# Altium schematic sheet V1_sch.SchDoc
size A1; SheetNumber: 1; SheetTotal: 5; SPICEModelCacheQUSBBUGH: <root> / <DocumentId>QUSBBUGH</DocumentId> / <CacheFrame Number="0"> / <Model Name="0805_885012107018_4.7uf" Kind="CKT"> / <Text>******* / .subckt 0805_885012107018_4.7uF 1 2 / Rser 1 3 0.00349429730952 / Lser 2 4 2.52123218E-10 / C1 3 4 0.0000047 / Rpar 3 4 20000000 / .ends 0805_885012107018_4.7uF</Text> / </Model> / </CacheFrame> / </root>
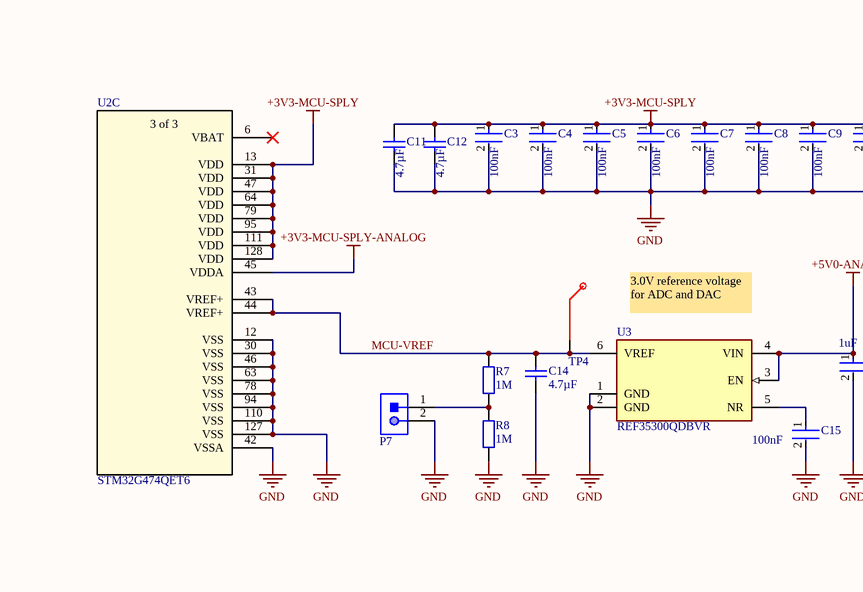
[diagram p0: V1_sch.SchDoc, top left]
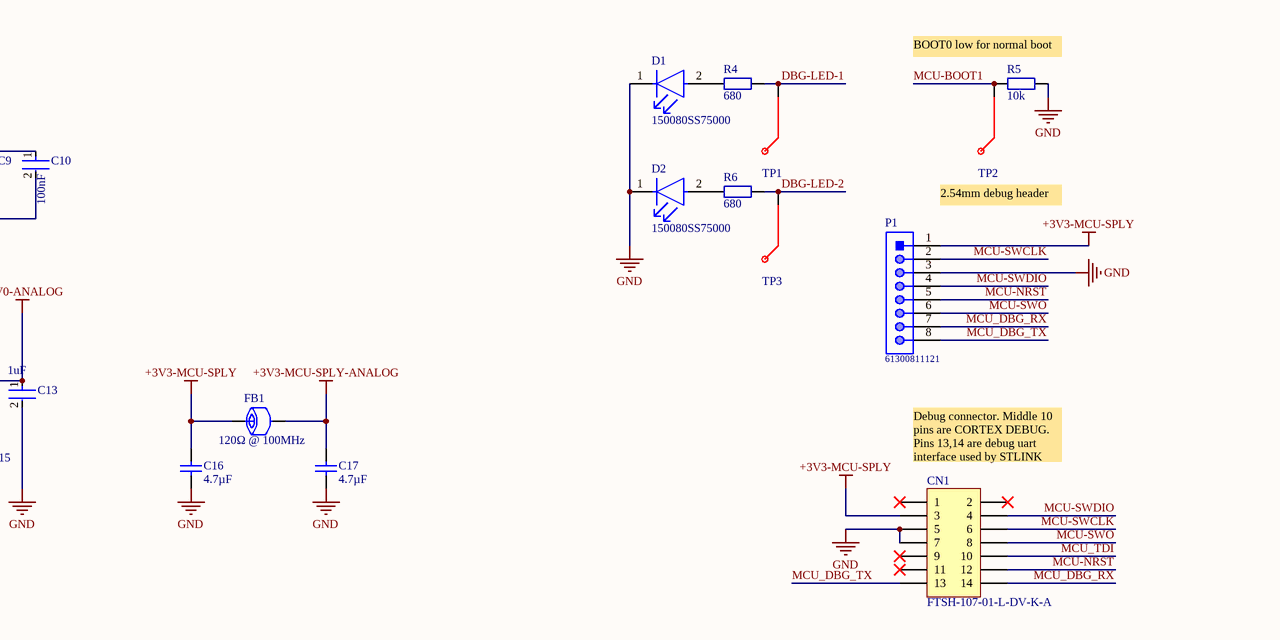
[diagram p1: V1_sch.SchDoc, top right]
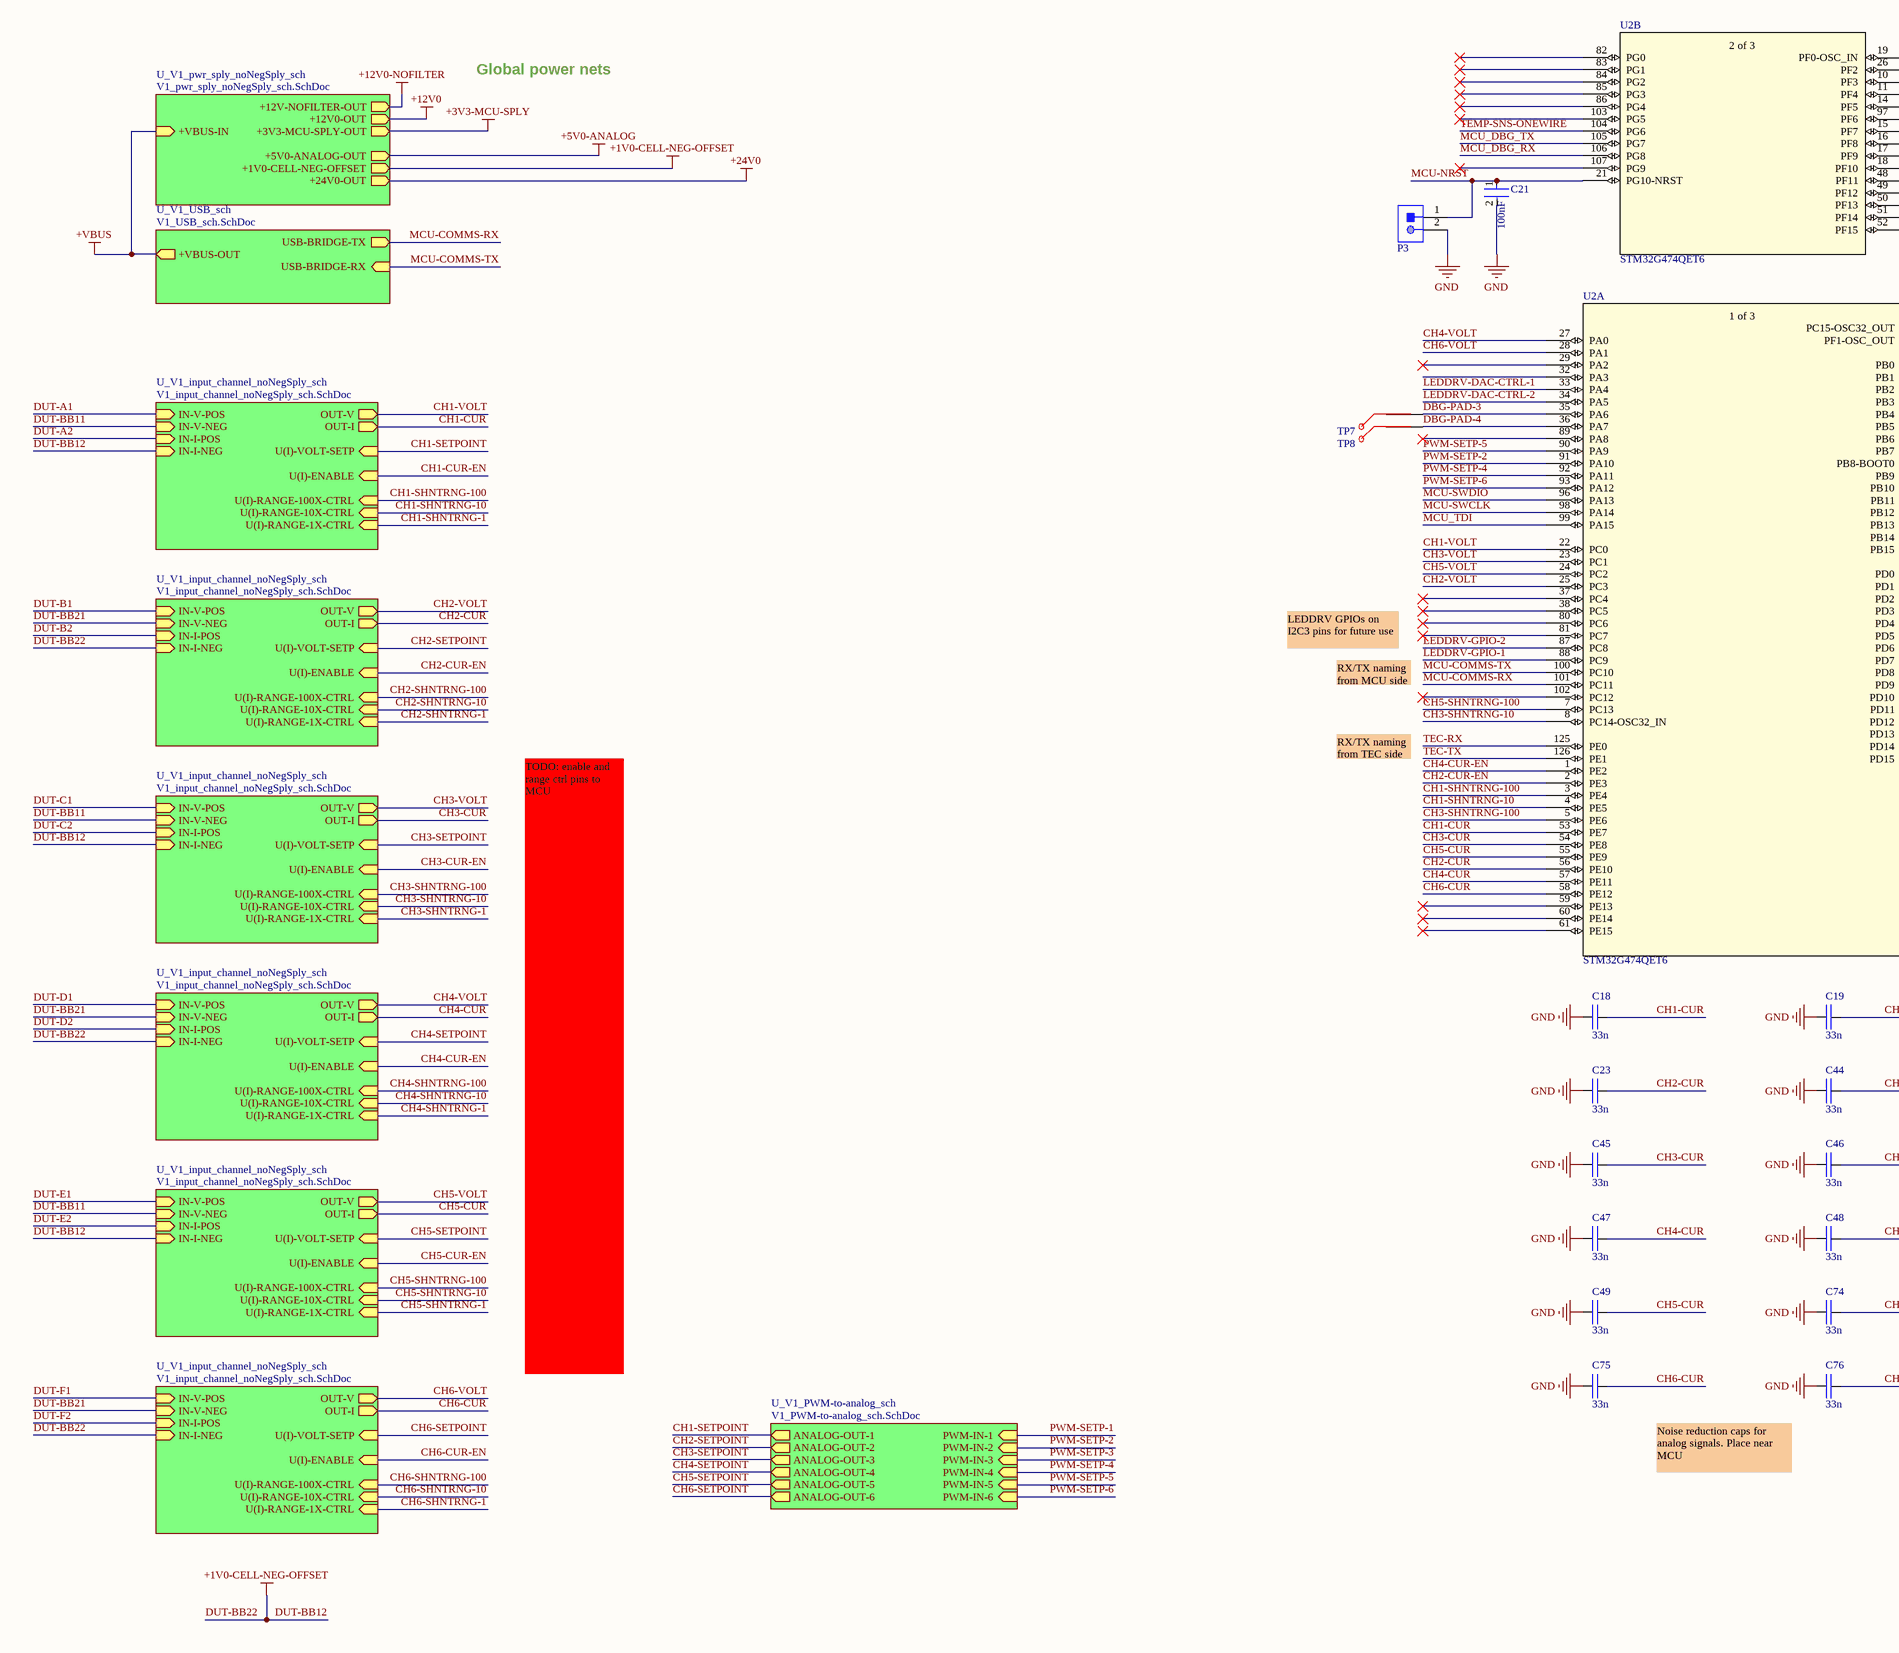
[diagram p2: V1_sch.SchDoc, bottom left]
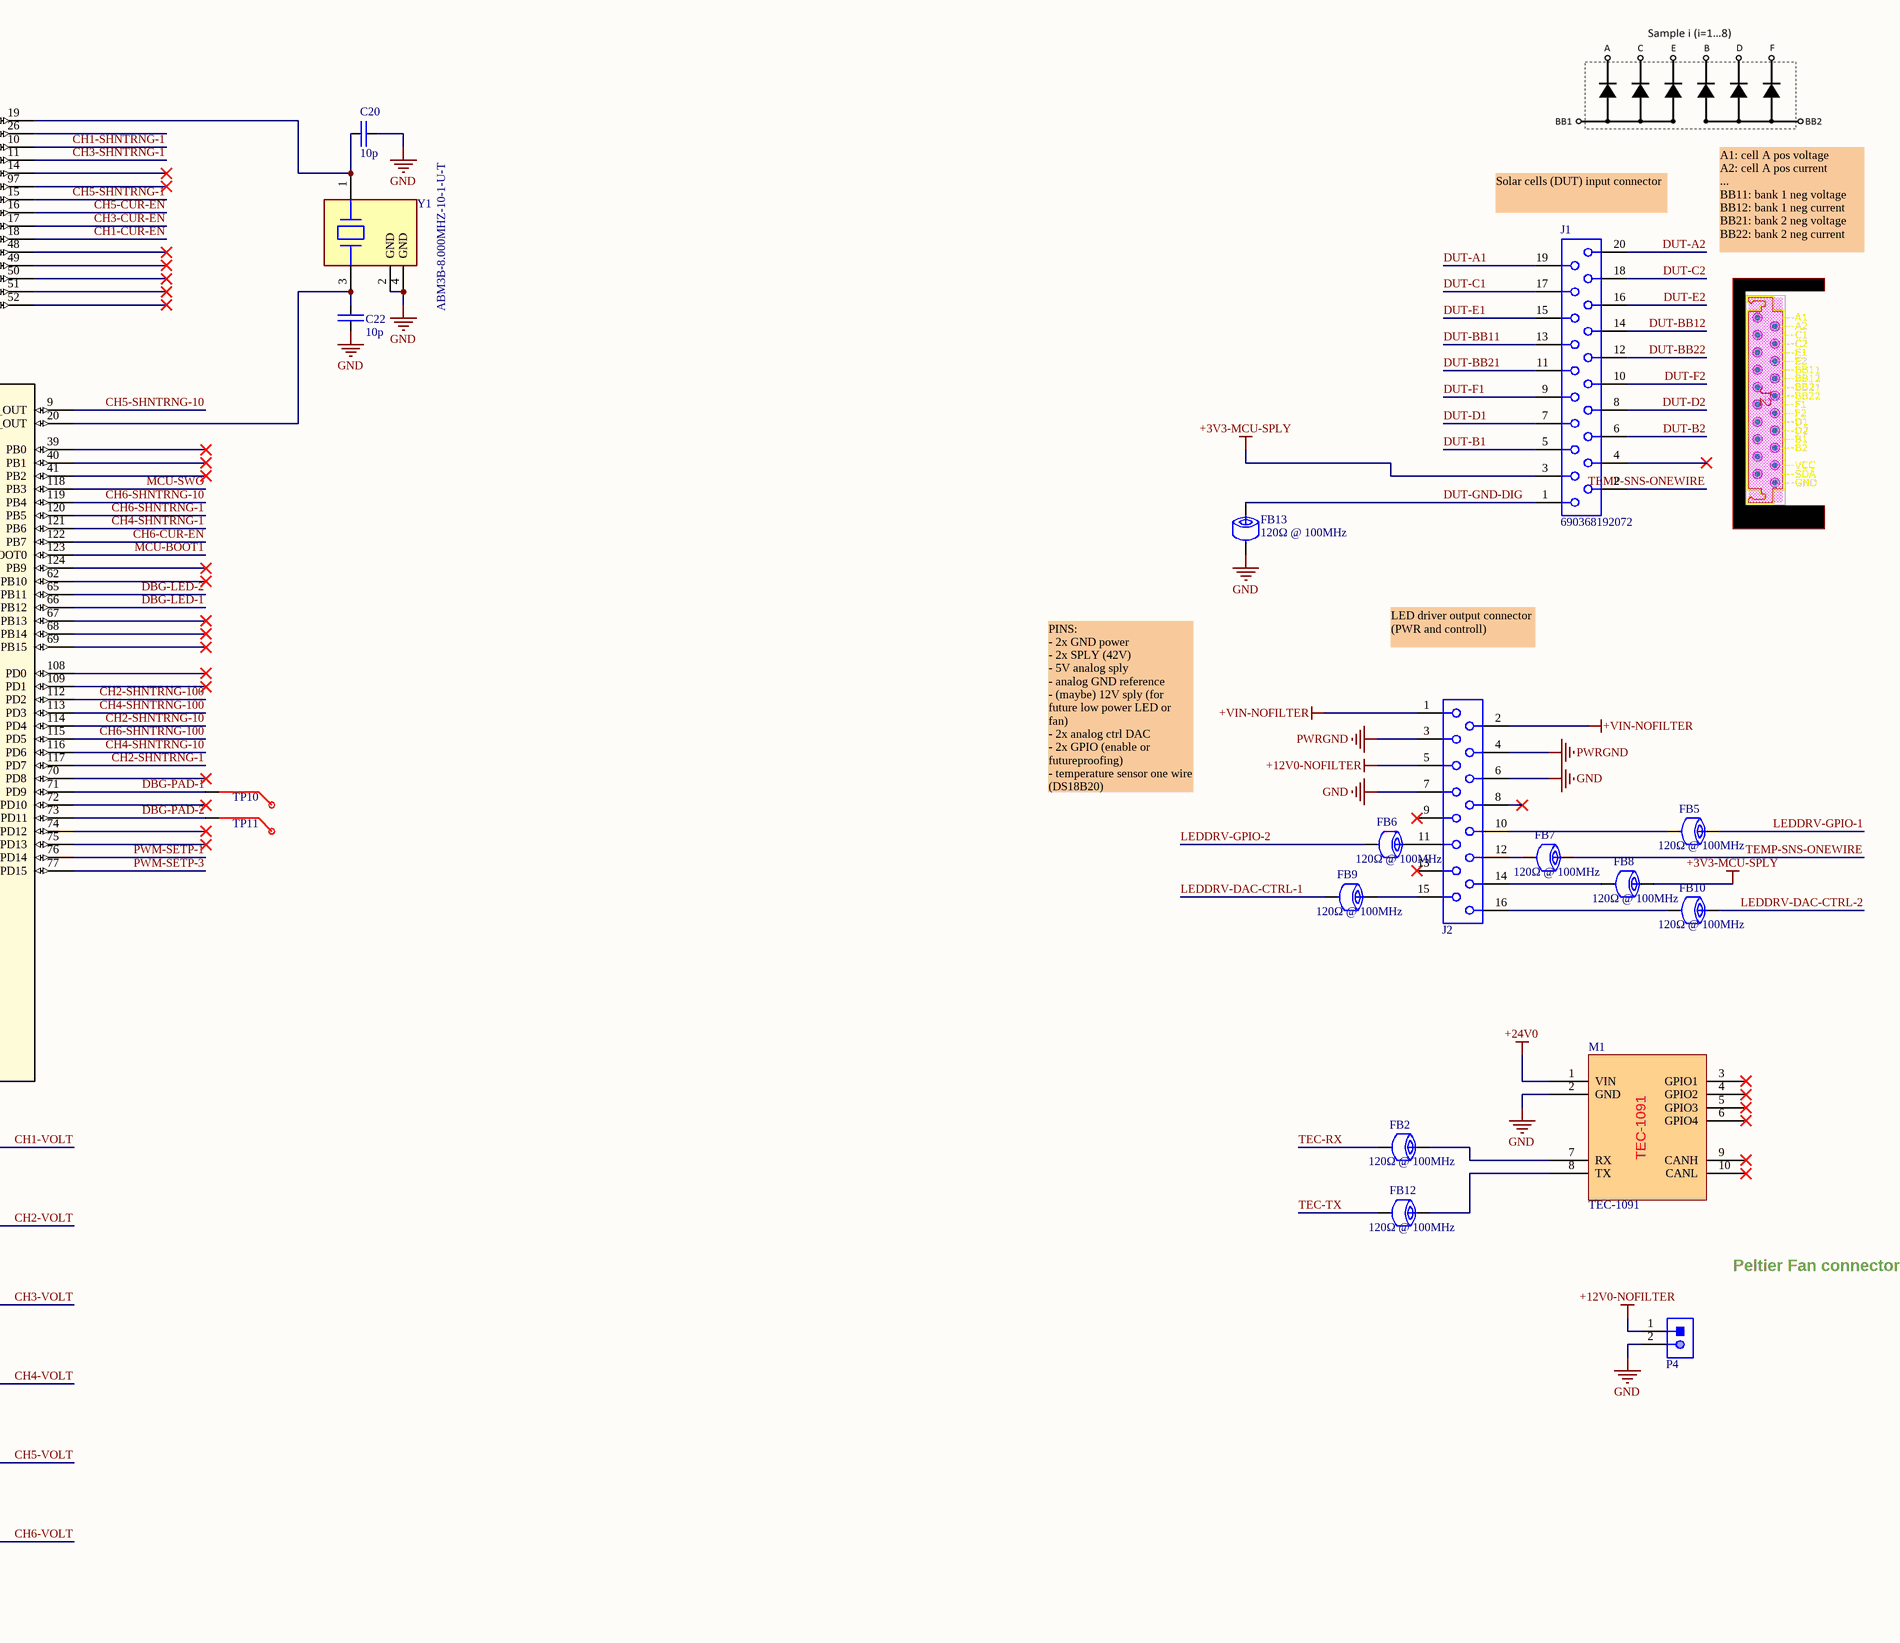
[diagram p3: V1_sch.SchDoc, bottom right]

## Parts
C3  Capacitance: 100nF  [FP-885012206095-IPC_B]  (hidden comment: 885012206095)
C4  Capacitance: 100nF  [FP-885012206095-IPC_B]  (hidden comment: 885012206095)
C5  Capacitance: 100nF  [FP-885012206095-IPC_B]  (hidden comment: 885012206095)
C6  Capacitance: 100nF  [FP-885012206095-IPC_B]  (hidden comment: 885012206095)
C7  Capacitance: 100nF  [FP-885012206095-IPC_B]  (hidden comment: 885012206095)
C8  Capacitance: 100nF  [FP-885012206095-IPC_B]  (hidden comment: 885012206095)
C9  Capacitance: 100nF  [FP-885012206095-IPC_B]  (hidden comment: 885012206095)
C10  Capacitance: 100nF  [FP-885012206095-IPC_B]  (hidden comment: 885012206095)
C11  Capacitance: 4.7µF  [WCAP-CSGP_0805_L2W1.25H1.25]  (hidden comment: 885012107018)
C12  Capacitance: 4.7µF  [WCAP-CSGP_0805_L2W1.25H1.25]  (hidden comment: 885012107018)
C13  Capacitance: 1uF  [FP-885012207078-IPC_B]  (hidden comment: 885012207078)
C14  Capacitance: 4.7µF  [WCAP-CSGP_0805_L2W1.25H1.25]  (hidden comment: 885012107018)
C15  Capacitance: 100nF  [FP-885012206095-IPC_B]  (hidden comment: 885012206095)
C16  Capacitance: 4.7µF  [WCAP-CSGP_0805_L2W1.25H1.25]  (hidden comment: 885012107018)
C17  Capacitance: 4.7µF  [WCAP-CSGP_0805_L2W1.25H1.25]  (hidden comment: 885012107018)
C18  value 33n  [FPR_0603_C_R0]  (hidden comment: PN_C0603_TBD)
C19  value 33n  [FPR_0603_C_R0]  (hidden comment: PN_C0603_TBD)
C20  value 10p  [FPR_0603_C_R0]  (hidden comment: PN_C0603_10p)
C21  Capacitance: 100nF  [FP-885012206095-IPC_B]  (hidden comment: 885012206095)
C22  value 10p  [FPR_0603_C_R0]  (hidden comment: PN_C0603_10p)
C23  value 33n  [FPR_0603_C_R0]  (hidden comment: PN_C0603_TBD)
C44  value 33n  [FPR_0603_C_R0]  (hidden comment: PN_C0603_TBD)
C45  value 33n  [FPR_0603_C_R0]  (hidden comment: PN_C0603_TBD)
C46  value 33n  [FPR_0603_C_R0]  (hidden comment: PN_C0603_TBD)
C47  value 33n  [FPR_0603_C_R0]  (hidden comment: PN_C0603_TBD)
C48  value 33n  [FPR_0603_C_R0]  (hidden comment: PN_C0603_TBD)
C49  value 33n  [FPR_0603_C_R0]  (hidden comment: PN_C0603_TBD)
C74  value 33n  [FPR_0603_C_R0]  (hidden comment: PN_C0603_TBD)
C75  value 33n  [FPR_0603_C_R0]  (hidden comment: PN_C0603_TBD)
C76  value 33n  [FPR_0603_C_R0]  (hidden comment: PN_C0603_TBD)
CN1  FTSH-107-01-L-DV-K-A  [CON_STDC14_Receiver_MEDIUM_WITH_MIPI10_3D]
D1  150080SS75000  [FP-150080SS75000-MFG]
D2  150080SS75000  [FP-150080SS75000-MFG]
FB1  120Ω @ 100MHz  [SMD_0805]
FB2  120Ω @ 100MHz  [SMD_0805]
FB5  120Ω @ 100MHz  [SMD_0805]
FB6  120Ω @ 100MHz  [SMD_0805]
FB7  120Ω @ 100MHz  [SMD_0805]
FB8  120Ω @ 100MHz  [SMD_0805]
FB9  120Ω @ 100MHz  [SMD_0805]
FB10  120Ω @ 100MHz  [SMD_0805]
FB12  120Ω @ 100MHz  [SMD_0805]
FB13  120Ω @ 100MHz  [SMD_0805]
J1  690368192072  [690368192072]
J2  690368191672  [690368191672]  (value not drawn)
M1  TEC-1091  [tec1091-pins]
P1  61300811121  [61300811121]
P3  61300211121  [61300211121]  (value not drawn)
P4  61300211121  [61300211121]  (value not drawn)
P7  61300211121  [61300211121]  (value not drawn)
R4  value 680  [FPR_0603_R_R0]  (hidden comment: PN_R0603_680R)
R5  value 10k  [FPR_0603_R_R0]  (hidden comment: PN_R0603_10k)
R6  value 680  [FPR_0603_R_R0]  (hidden comment: PN_R0603_680R)
R7  value 1M  [FPR_0603_R_R0]  (hidden comment: PN_R0603_1M)
R8  value 1M  [FPR_0603_R_R0]  (hidden comment: PN_R0603_1M)
TP1  Test Point  [Test Point 1.5mm SMD]  (value not drawn)
TP2  Test Point  [Test Point 1.5mm SMD]  (value not drawn)
TP3  Test Point  [Test Point 1.5mm SMD]  (value not drawn)
TP4  Test Point  [Test Point 1.5mm SMD]  (value not drawn)
TP7  Test Point  [Test Point 1.5mm SMD]  (value not drawn)
TP8  Test Point  [Test Point 1.5mm SMD]  (value not drawn)
TP10  Test Point  [Test Point 1.5mm SMD]  (value not drawn)
TP11  Test Point  [Test Point 1.5mm SMD]  (value not drawn)
U2  STM32G474QET6  [LPQFP-128]  (parts A,B,C of 3)
U3  REF35300QDBVR  [FP-DBV0006A-MFG]
Y1  ABM3B-8.000MHZ-10-1-U-T  [FP-ABM3B-MFG]

## Sub-sheets
U_V1_input_channel_noNegSply_sch = V1_input_channel_noNegSply_sch.SchDoc: OUT-V (out), IN-V-POS (in), IN-V-NEG (in), IN-I-POS (in), U(I)-ENABLE (in), U(I)-VOLT-SETP (in), U(I)-RANGE-100X-CTRL (in), U(I)-RANGE-10X-CTRL (in), U(I)-RANGE-1X-CTRL (in), OUT-I (out), IN-I-NEG (in)
U_V1_input_channel_noNegSply_sch = V1_input_channel_noNegSply_sch.SchDoc: OUT-V (out), IN-V-POS (in), IN-V-NEG (in), IN-I-NEG (in), IN-I-POS (in), U(I)-ENABLE (in), U(I)-VOLT-SETP (in), U(I)-RANGE-100X-CTRL (in), U(I)-RANGE-10X-CTRL (in), U(I)-RANGE-1X-CTRL (in), OUT-I (out)
U_V1_input_channel_noNegSply_sch = V1_input_channel_noNegSply_sch.SchDoc: OUT-V (out), IN-V-POS (in), IN-V-NEG (in), IN-I-NEG (in), IN-I-POS (in), U(I)-ENABLE (in), U(I)-VOLT-SETP (in), U(I)-RANGE-100X-CTRL (in), U(I)-RANGE-10X-CTRL (in), U(I)-RANGE-1X-CTRL (in), OUT-I (out)
U_V1_input_channel_noNegSply_sch = V1_input_channel_noNegSply_sch.SchDoc: OUT-V (out), IN-V-POS (in), IN-V-NEG (in), IN-I-NEG (in), IN-I-POS (in), U(I)-ENABLE (in), U(I)-VOLT-SETP (in), U(I)-RANGE-100X-CTRL (in), U(I)-RANGE-10X-CTRL (in), U(I)-RANGE-1X-CTRL (in), OUT-I (out)
U_V1_input_channel_noNegSply_sch = V1_input_channel_noNegSply_sch.SchDoc: OUT-V (out), IN-V-POS (in), IN-V-NEG (in), IN-I-NEG (in), IN-I-POS (in), U(I)-ENABLE (in), U(I)-VOLT-SETP (in), U(I)-RANGE-100X-CTRL (in), U(I)-RANGE-10X-CTRL (in), U(I)-RANGE-1X-CTRL (in), OUT-I (out)
U_V1_input_channel_noNegSply_sch = V1_input_channel_noNegSply_sch.SchDoc: OUT-V (out), IN-V-POS (in), IN-V-NEG (in), IN-I-NEG (in), IN-I-POS (in), U(I)-ENABLE (in), U(I)-VOLT-SETP (in), U(I)-RANGE-100X-CTRL (in), U(I)-RANGE-10X-CTRL (in), U(I)-RANGE-1X-CTRL (in), OUT-I (out)
U_V1_PWM-to-analog_sch = V1_PWM-to-analog_sch.SchDoc: PWM-IN-1 (in), PWM-IN-2 (in), PWM-IN-3 (in), PWM-IN-4 (in), PWM-IN-5 (in), PWM-IN-6 (in), ANALOG-OUT-1 (out), ANALOG-OUT-2 (out), ANALOG-OUT-3 (out), ANALOG-OUT-4 (out), ANALOG-OUT-5 (out), ANALOG-OUT-6 (out)
U_V1_pwr_sply_noNegSply_sch = V1_pwr_sply_noNegSply_sch.SchDoc: +12V-NOFILTER-OUT (out), +12V0-OUT (out), +3V3-MCU-SPLY-OUT (out), +5V0-ANALOG-OUT (out), +VBUS-IN (in), +1V0-CELL-NEG-OFFSET (out), +24V0-OUT (out)
U_V1_USB_sch = V1_USB_sch.SchDoc: USB-BRIDGE-TX (out), USB-BRIDGE-RX (in), +VBUS-OUT (out)

## Nets
+3V3-MCU-SPLY: C3.1 C4.1 C5.1 C6.1 C7.1 C8.1 C9.1 C10.1 C11.2 C12.2 C16.2 CN1.3 FB1.1 FB8.1 J1.3 P1.1 U2.13(VDD) U2.31(VDD) U2.47(VDD) U2.64(VDD) U2.79(VDD) U2.95(VDD) U2.111(VDD) U2.128(VDD) ; sheet U_V1_pwr_sply_noNegSply_sch/+3V3-MCU-SPLY-OUT
+3V3-MCU-SPLY-ANALOG: C17.2 FB1.2 U2.45(VDDA)
+5V0-ANALOG: C13.1 U3.3(EN) U3.4(VIN) ; sheet U_V1_pwr_sply_noNegSply_sch/+5V0-ANALOG-OUT
+12V0: sheet U_V1_pwr_sply_noNegSply_sch/+12V0-OUT
+12V0-NOFILTER: J2.5 P4.1 ; sheet U_V1_pwr_sply_noNegSply_sch/+12V-NOFILTER-OUT
+24V0: M1.1(VIN) ; sheet U_V1_pwr_sply_noNegSply_sch/+24V0-OUT
+VBUS: sheet U_V1_pwr_sply_noNegSply_sch/+VBUS-IN, sheet U_V1_USB_sch/+VBUS-OUT
+VIN-NOFILTER: J2.1 J2.2
DUT-BB12: J1.12 J1.14 ; sheet U_V1_pwr_sply_noNegSply_sch/+1V0-CELL-NEG-OFFSET, sheet U_V1_input_channel_noNegSply_sch/IN-I-NEG, sheet U_V1_input_channel_noNegSply_sch/IN-I-NEG, sheet U_V1_input_channel_noNegSply_sch/IN-I-NEG, sheet U_V1_input_channel_noNegSply_sch/IN-I-NEG, sheet U_V1_input_channel_noNegSply_sch/IN-I-NEG, sheet U_V1_input_channel_noNegSply_sch/IN-I-NEG  [also labelled +1V0-CELL-NEG-OFFSET, DUT-BB22]
GND: C3.2 C4.2 C5.2 C6.2 C7.2 C8.2 C9.2 C10.2 C11.1 C12.1 C13.2 C14.1 C15.2 C16.1 C17.1 C18.2 C19.2 C20.2 C21.2 C22.2 C23.2 C44.2 C45.2 C46.2 C47.2 C48.2 C49.2 C74.2 C75.2 C76.2 CN1.5 CN1.7 D1.1(C) D2.1(C) FB13.2 J2.6 J2.7 M1.2(GND) P1.3 P3.2 P4.2 P7.2 R5.1 R8.2 U2.12(VSS) U2.30(VSS) U2.42(VSSA) U2.46(VSS) U2.63(VSS) U2.78(VSS) U2.94(VSS) U2.110(VSS) U2.127(VSS) U3.1(GND) U3.2(GND) Y1.2(GND) Y1.4(GND)
PWRGND: J2.3 J2.4
CH1-CUR: C18.1 U2.53(PE7) ; sheet U_V1_input_channel_noNegSply_sch/OUT-I
CH1-CUR-EN: U2.18(PF10) ; sheet U_V1_input_channel_noNegSply_sch/U(I)-ENABLE
CH1-SETPOINT: sheet U_V1_input_channel_noNegSply_sch/U(I)-VOLT-SETP, sheet U_V1_PWM-to-analog_sch/ANALOG-OUT-1
CH1-SHNTRNG-1: U2.10(PF3) ; sheet U_V1_input_channel_noNegSply_sch/U(I)-RANGE-1X-CTRL
CH1-SHNTRNG-10: U2.4(PE5) ; sheet U_V1_input_channel_noNegSply_sch/U(I)-RANGE-10X-CTRL
CH1-SHNTRNG-100: U2.3(PE4) ; sheet U_V1_input_channel_noNegSply_sch/U(I)-RANGE-100X-CTRL
CH1-VOLT: C19.1 U2.22(PC0) ; sheet U_V1_input_channel_noNegSply_sch/OUT-V
CH2-CUR: C23.1 U2.56(PE10) ; sheet U_V1_input_channel_noNegSply_sch/OUT-I
CH2-CUR-EN: U2.2(PE3) ; sheet U_V1_input_channel_noNegSply_sch/U(I)-ENABLE
CH2-SETPOINT: sheet U_V1_input_channel_noNegSply_sch/U(I)-VOLT-SETP, sheet U_V1_PWM-to-analog_sch/ANALOG-OUT-2
CH2-SHNTRNG-1: U2.117(PD7) ; sheet U_V1_input_channel_noNegSply_sch/U(I)-RANGE-1X-CTRL
CH2-SHNTRNG-10: U2.114(PD4) ; sheet U_V1_input_channel_noNegSply_sch/U(I)-RANGE-10X-CTRL
CH2-SHNTRNG-100: U2.112(PD2) ; sheet U_V1_input_channel_noNegSply_sch/U(I)-RANGE-100X-CTRL
CH2-VOLT: C44.1 U2.25(PC3) ; sheet U_V1_input_channel_noNegSply_sch/OUT-V
CH3-CUR: C45.1 U2.54(PE8) ; sheet U_V1_input_channel_noNegSply_sch/OUT-I
CH3-CUR-EN: U2.17(PF9) ; sheet U_V1_input_channel_noNegSply_sch/U(I)-ENABLE
CH3-SETPOINT: sheet U_V1_input_channel_noNegSply_sch/U(I)-VOLT-SETP, sheet U_V1_PWM-to-analog_sch/ANALOG-OUT-3
CH3-SHNTRNG-1: U2.11(PF4) ; sheet U_V1_input_channel_noNegSply_sch/U(I)-RANGE-1X-CTRL
CH3-SHNTRNG-10: U2.8(PC14-OSC32_IN) ; sheet U_V1_input_channel_noNegSply_sch/U(I)-RANGE-10X-CTRL
CH3-SHNTRNG-100: U2.5(PE6) ; sheet U_V1_input_channel_noNegSply_sch/U(I)-RANGE-100X-CTRL
CH3-VOLT: C46.1 U2.23(PC1) ; sheet U_V1_input_channel_noNegSply_sch/OUT-V
CH4-CUR: C47.1 U2.57(PE11) ; sheet U_V1_input_channel_noNegSply_sch/OUT-I
CH4-CUR-EN: U2.1(PE2) ; sheet U_V1_input_channel_noNegSply_sch/U(I)-ENABLE
CH4-SETPOINT: sheet U_V1_input_channel_noNegSply_sch/U(I)-VOLT-SETP, sheet U_V1_PWM-to-analog_sch/ANALOG-OUT-4
CH4-SHNTRNG-1: U2.121(PB6) ; sheet U_V1_input_channel_noNegSply_sch/U(I)-RANGE-1X-CTRL
CH4-SHNTRNG-10: U2.116(PD6) ; sheet U_V1_input_channel_noNegSply_sch/U(I)-RANGE-10X-CTRL
CH4-SHNTRNG-100: U2.113(PD3) ; sheet U_V1_input_channel_noNegSply_sch/U(I)-RANGE-100X-CTRL
CH4-VOLT: C48.1 U2.27(PA0) ; sheet U_V1_input_channel_noNegSply_sch/OUT-V
CH5-CUR: C49.1 U2.55(PE9) ; sheet U_V1_input_channel_noNegSply_sch/OUT-I
CH5-CUR-EN: U2.16(PF8) ; sheet U_V1_input_channel_noNegSply_sch/U(I)-ENABLE
CH5-SETPOINT: sheet U_V1_input_channel_noNegSply_sch/U(I)-VOLT-SETP, sheet U_V1_PWM-to-analog_sch/ANALOG-OUT-5
CH5-SHNTRNG-1: U2.15(PF7) ; sheet U_V1_input_channel_noNegSply_sch/U(I)-RANGE-1X-CTRL
CH5-SHNTRNG-10: U2.9(PC15-OSC32_OUT) ; sheet U_V1_input_channel_noNegSply_sch/U(I)-RANGE-10X-CTRL
CH5-SHNTRNG-100: U2.7(PC13) ; sheet U_V1_input_channel_noNegSply_sch/U(I)-RANGE-100X-CTRL
CH5-VOLT: C74.1 U2.24(PC2) ; sheet U_V1_input_channel_noNegSply_sch/OUT-V
CH6-CUR: C75.1 U2.58(PE12) ; sheet U_V1_input_channel_noNegSply_sch/OUT-I
CH6-CUR-EN: U2.122(PB7) ; sheet U_V1_input_channel_noNegSply_sch/U(I)-ENABLE
CH6-SETPOINT: sheet U_V1_input_channel_noNegSply_sch/U(I)-VOLT-SETP, sheet U_V1_PWM-to-analog_sch/ANALOG-OUT-6
CH6-SHNTRNG-1: U2.120(PB5) ; sheet U_V1_input_channel_noNegSply_sch/U(I)-RANGE-1X-CTRL
CH6-SHNTRNG-10: U2.119(PB4) ; sheet U_V1_input_channel_noNegSply_sch/U(I)-RANGE-10X-CTRL
CH6-SHNTRNG-100: U2.115(PD5) ; sheet U_V1_input_channel_noNegSply_sch/U(I)-RANGE-100X-CTRL
CH6-VOLT: C76.1 U2.28(PA1) ; sheet U_V1_input_channel_noNegSply_sch/OUT-V
DBG-LED-1: R4.1 TP1.1 U2.66(PB12)
DBG-LED-2: R6.1 TP3.1 U2.65(PB11)
DBG-PAD-1: TP10.1 U2.71(PD9)
DBG-PAD-2: TP11.1 U2.73(PD11)
DBG-PAD-3: TP7.1 U2.35(PA6)
DBG-PAD-4: TP8.1 U2.36(PA7)
DUT-A1: J1.19 ; sheet U_V1_input_channel_noNegSply_sch/IN-V-POS
DUT-A2: J1.20 ; sheet U_V1_input_channel_noNegSply_sch/IN-I-POS
DUT-B1: J1.5 ; sheet U_V1_input_channel_noNegSply_sch/IN-V-POS
DUT-B2: J1.6 ; sheet U_V1_input_channel_noNegSply_sch/IN-I-POS
DUT-BB11: J1.13 ; sheet U_V1_input_channel_noNegSply_sch/IN-V-NEG, sheet U_V1_input_channel_noNegSply_sch/IN-V-NEG, sheet U_V1_input_channel_noNegSply_sch/IN-V-NEG
DUT-BB21: J1.11 ; sheet U_V1_input_channel_noNegSply_sch/IN-V-NEG, sheet U_V1_input_channel_noNegSply_sch/IN-V-NEG, sheet U_V1_input_channel_noNegSply_sch/IN-V-NEG
DUT-C1: J1.17 ; sheet U_V1_input_channel_noNegSply_sch/IN-V-POS
DUT-C2: J1.18 ; sheet U_V1_input_channel_noNegSply_sch/IN-I-POS
DUT-D1: J1.7 ; sheet U_V1_input_channel_noNegSply_sch/IN-V-POS
DUT-D2: J1.8 ; sheet U_V1_input_channel_noNegSply_sch/IN-I-POS
DUT-E1: J1.15 ; sheet U_V1_input_channel_noNegSply_sch/IN-V-POS
DUT-E2: J1.16 ; sheet U_V1_input_channel_noNegSply_sch/IN-I-POS
DUT-F1: J1.9 ; sheet U_V1_input_channel_noNegSply_sch/IN-V-POS
DUT-F2: J1.10 ; sheet U_V1_input_channel_noNegSply_sch/IN-I-POS
DUT-GND-DIG: FB13.1 J1.1
LEDDRV-DAC-CTRL-1: FB9.2 U2.33(PA4)
LEDDRV-DAC-CTRL-2: FB10.1 U2.34(PA5)
LEDDRV-GPIO-1: FB5.1 U2.88(PC9)
LEDDRV-GPIO-2: FB6.2 U2.87(PC8)
MCU-BOOT1: R5.2 TP2.1 U2.123(PB8-BOOT0)
MCU-COMMS-RX: U2.101(PC11) ; sheet U_V1_USB_sch/USB-BRIDGE-TX
MCU-COMMS-TX: U2.100(PC10) ; sheet U_V1_USB_sch/USB-BRIDGE-RX
MCU-NRST: C21.1 CN1.12 P1.5 P3.1 U2.21(PG10-NRST)
MCU-SWCLK: CN1.6 P1.2 U2.98(PA14)
MCU-SWDIO: CN1.4 P1.4 U2.96(PA13)
MCU-SWO: CN1.8 P1.6 U2.118(PB3)
MCU-VREF: C14.2 R7.1 TP4.1 U2.43(VREF+) U2.44(VREF+) U3.6(VREF)
MCU_DBG_RX: CN1.14 P1.7 U2.106(PG8)
MCU_DBG_TX: CN1.13 P1.8 U2.105(PG7)
MCU_TDI: CN1.10 U2.99(PA15)
PWM-SETP-1: U2.76(PD14) ; sheet U_V1_PWM-to-analog_sch/PWM-IN-1
PWM-SETP-2: U2.91(PA10) ; sheet U_V1_PWM-to-analog_sch/PWM-IN-2
PWM-SETP-3: U2.77(PD15) ; sheet U_V1_PWM-to-analog_sch/PWM-IN-3
PWM-SETP-4: U2.92(PA11) ; sheet U_V1_PWM-to-analog_sch/PWM-IN-4
PWM-SETP-5: U2.90(PA9) ; sheet U_V1_PWM-to-analog_sch/PWM-IN-5
PWM-SETP-6: U2.93(PA12) ; sheet U_V1_PWM-to-analog_sch/PWM-IN-6
TEC-RX: FB2.2 U2.125(PE0)
TEC-TX: FB12.2 U2.126(PE1)
TEMP-SNS-ONEWIRE: FB7.1 J1.2 U2.104(PG6)
NetC15_1: C15.1 U3.5(NR)
NetC20_1: C20.1 U2.19(PF0-OSC_IN) Y1.1
NetC22_1: C22.1 U2.20(PF1-OSC_OUT) Y1.3
NetD1_2: D1.2(A) R4.2
NetD2_2: D2.2(A) R6.2
NetFB2_1: FB2.1 M1.7(RX)
NetFB5_2: FB5.2 J2.10
NetFB6_1: FB6.1 J2.11
NetFB7_2: FB7.2 J2.12
NetFB8_2: FB8.2 J2.14
NetFB9_1: FB9.1 J2.15
NetFB10_2: FB10.2 J2.16
NetFB12_1: FB12.1 M1.8(TX)
NetP7_1: P7.1 R7.2 R8.1

Not connected (* = marked no-connect by the designer): CN1 1* 2* 9* 11*; J1 4*; J2 8* 9* 13*; M1 3(GPIO1)* 4(GPIO2)* 5(GPIO3)* 6(GPIO4)* 9(CANH)* 10(CANL)*; U2 6(VBAT)* 14(PF5)* 26(PF2) 29(PA2)* 32(PA3) 37(PC4)* 38(PC5)* 39(PB0)* 40(PB1)* 41(PB2)* 48(PF11)* 49(PF12)* 50(PF13)* 51(PF14)* 52(PF15)* 59(PE13)* 60(PE14)* 61(PE15)* 62(PB10)* 67(PB13)* 68(PB14)* 69(PB15)* 70(PD8)* 72(PD10)* 74(PD12)* 75(PD13)* 80(PC6)* 81(PC7)* 82(PG0)* 83(PG1)* 84(PG2)* 85(PG3)* 86(PG4)* 89(PA8)* 97(PF6)* 102(PC12)* 103(PG5)* 107(PG9)* 108(PD0)* 109(PD1)* 124(PB9)*

## Notes on the sheet
- (near R5) BOOT0 low for normal boot
- 2.54mm debug header
- 3.0V reference voltage for ADC and DAC
- (near CN1) Debug connector. Middle 10 pins are CORTEX DEBUG. Pins 13,14 are debug uart interface used by STLINK devices.
- Global power nets
- (near J1) Solar cells (DUT) input connector
- A1: cell A pos voltage
  A2: cell A pos current
  ...
  BB11: bank 1 neg voltage
  BB12: bank 1 neg current
  BB21: bank 2 neg voltage
  BB22: bank 2 neg current
- LED driver output connector (PWR and controll)
- LEDDRV GPIOs on I2C3 pins for future use
- RX/TX naming from MCU side
- PINS:
  - 2x GND power
  - 2x SPLY (42V)
  - 5V analog sply
  - analog GND reference
  - (maybe) 12V sply (for future low power LED or fan)
  - 2x analog ctrl DAC
  - 2x GPIO (enable or futureproofing)
  - temperature sensor one wire (DS18B20)
- RX/TX naming from TEC side
- Peltier Fan connector
- TODO: enable and range ctrl pins to MCU
- Noise reduction caps for analog signals. Place near MCU
- (in symbol STM32G474QET6, part A) 1 of 3
- (in symbol STM32G474QET6, part B) 2 of 3
- (in symbol STM32G474QET6, part C) 3 of 3

## Library data of the parts
C3-C10 C15 C21 = CMP-207839-000004-1: CAP CER 0.1UF 50V X7R 0603; Tolerance: 10%; RoHS Compliant: Yes; Thickness: 0.037inch; Voltage Rating: 50V; Packaging: Cut Tape; Dielectric: X7R; Series: WCAP-CSGP; Width: 0.031inch; Max Operating Temperature: 125°C; Min Operating Temperature: -55°C; Case/Package: 0603; Case Code (Metric): 1608; Case Code (Imperial): 0603; Length: 0.063inch; Mount: Surface Mount; Voltage Rating (DC): 50V
C11 C12 C14 C16 C17 = 885012107018: WCAP-CSGP Multilayer Ceramic Chip Capacitor, General Purpose, size 0805, X5R, 4.7µF, 25VDC; Manufacturer: Wurth Elektronik; Case/Size Code: 0805; Capacitance Tolerance: +/-20%; Dissipation Factor: 10%; Insulation Resistance: 0.02GΩ; Rated Voltage (DC): 25V; Technical Reference: X5R0805475M025DFCT10000; Manufacturer Part Number: 885012107018; Category: Multilayer Ceramic Chip Capacitors; Match Code: WCAP-CSGP; ComponentLink1Description: Website Link; ComponentLink1URL: https://www.we-online.com/redexpert/article/885012107018?ad; ComponentLink2Description: Datasheet Link; ComponentLink2URL: https://www.we-online.com/redexpert/spec/885012107018?ad; Mount: Surface Mount; Operating Temperature Max: 85°C; Operating Temperature Min: -55°C; Packaging: Tape and Reel; Length: 2mm; Width: 1.25mm; Height: 1.25mm; Ceramic Type: X5R
C13 = CMP-207839-000010-1: CAP CER 1UF 25V X7R 0805; Tolerance: 10%; Series: WCAP-CSGP; Mount: Surface Mount; RoHS Compliant: Yes; Case Code (Metric): 2012; Width: 0.049inch; Thickness: 0.053inch; Dielectric: X7R; Max Operating Temperature: 125°C; Case Code (Imperial): 0805; Case/Package: 0805; Length: 0.079inch; Voltage Rating: 25V; Packaging: Cut Tape; Min Operating Temperature: -55°C; Voltage Rating (DC): 25V
C18-C20 C22 C23 C44-C49 C74-C76 = C: Capacitor - generic SMD
CN1 = FTSH-107-01-L-DV-K-A: Header 7x2, 1.27mm, Dual row, Straight, Surface mount, vertical male connector. 3.05mm lead. Mates with FFSD connector. Footprint compatible with FTSH-107-01-L-DV,-K,-A,-P,-ES (STDC14 MEDIUM)
D1 D2 = CMP-1426-00010-2: LED RED CLEAR 0805 SMD; Forward Voltage: 1.9V; Luminous Intensity: 60mcd; Dominant Wavelength: 630nm; Forward Current: 30mA; Viewing Angle: 140°; Lens Color: Colorless; Test Current: 20mA; Lens Size: 1.25mm; Packaging: Cut Tape; Width: 1.25mm; Case Code (Metric): 2012; Max Operating Temperature: 85°C; RoHS Compliant: Yes; Mount: Surface Mount; Case/Package: 0805; Series: WL-SMCW; Length: 2mm; Case Code (Imperial): 0805; Wavelength: 630nm; Lens Style: Clear; Min Operating Temperature: -40°C; Color: Red; Lens Transparency: Clear; Package Quantity: 1; Height: 0.8mm
FB1 FB2 FB5-FB10 FB12 FB13 = BLM21AG121SN1D: Ferrite Bead, 0805 [2012 Metric], 120 ohm, 800 mA, BLM21A Series, 0.15 ohm, ± 25%; Manufacturer: Murata; Dealer number: 1515617; Dealer: Farnell; DC resistance: 0.15Ω; Max current: 0.2A; Category: ferite beads; Price: 0.082; Manufacturer Number: BLM21AG121SN1D; AC resistance: 120Ω; Frequency: 100MHz; Case: 0805; Technology: SMT; HelpURL: https://www.farnell.com/datasheets/1914683.pdf
J1 = 690368192072: WR-MM Mini Module Connector, Female, THT, with Latch & Polarization, Angled, pitch 2.54mm, 20p; Manufacturer: Wurth Elektronik; Insulation Resistance: 1000MΩ; Rated Current: 1.5A; Working Voltage: 250VAC; Withstanding Voltage: 500VAC; Contact Resistance: 10mΩ; ComponentLink1Description: Website Link; ComponentLink1URL: https://www.we-online.com/redexpert/article/690368192072?ad; ComponentLink2Description: Datasheet Link; ComponentLink2URL: https://www.we-online.com/redexpert/spec/690368192072?ad; Manufacturer Part Number: 690368192072; Pitch: 2.54mm; Packaging: Tube; Gender: Female; Length: 30mm; Category: Board-to-Board Connectors; Match Code: WR-MM; Mount: Through Hole; Operating Temperature Max: 105°C; Operating Temperature Min: -40°C; Number of Pins: 20; Orientation: Angled
J2 = 690368191672: WR-MM Mini Module Connector, Female, THT, with Latch & Polarization, Angled, pitch 2.54mm, 16p; Manufacturer: Wurth Elektronik; Contact Resistance: 10mΩ; Insulation Resistance: 1000MΩ; Rated Current: 1.5A; Working Voltage: 250VAC; Withstanding Voltage: 500VAC; ComponentLink1Description: Website Link; ComponentLink1URL: https://www.we-online.com/redexpert/article/690368191672?ad; ComponentLink2Description: Datasheet Link; ComponentLink2URL: https://www.we-online.com/redexpert/spec/690368191672?ad; Manufacturer Part Number: 690368191672; Category: Board-to-Board Connectors; Match Code: WR-MM; Mount: Through Hole; Operating Temperature Max: 105°C; Operating Temperature Min: -40°C; Packaging: Tube; Length: 24.92mm; Gender: Female; Number of Pins: 16; Orientation: Angled; Pitch: 2.54mm
M1 = TEC-1091: Peltier control module
P1 = CMP-1502-01076-1: THT Vertical Pin Header WR-PHD, Pitch 2.54 mm, Single Row, 8 pins; Manufacturer: Wurth Elektronik; Rated Current: 3A; Pin Number: 8; Working Voltage: 250VAC; Gender: Male; Contact Resistance: 20mOhm; Pitch: 2.54mm; Withstanding Voltage: 500VAC; Publisher: WurthElektronik; Operating Temperature: -40to105degC; Orientation: Vertical; Row Number: Single; Part Number: 61300811121; Package Reference: 61300811121; Mounting Technology: THT; Packaging: Bag; Manufacturer URL: http://www.we-online.de; Datasheet URL: https://katalog.we-online.de/em/datasheet/6130xx11121.pdf
P3 P4 P7 = CMP-1712-00002-4: THT Vertical Pin Header WR-PHD, Pitch 2.54 mm, Single Row, 2 pins; Manufacturer: Wurth Elektronik; Rated Current: 3A; Gender: Male; Withstanding Voltage: 500VAC; Working Voltage: 250VAC; Pitch: 2.54mm; Contact Resistance: 20mOhm; Pin Number: 2; Mounting Technology: THT; Orientation: Vertical; Operating Temperature: -40to105degC; Packaging: Bag; Publisher: WurthElektronik; Datasheet URL: https://katalog.we-online.de/em/datasheet/6130xx11121.pdf; Manufacturer URL: http://www.we-online.de; Row Number: Single; Package Reference: 61300211121; Part Number: 61300211121
R4-R8 = R: Resistor - generic SMD
U2 = STM32G474QET6: No Description Available; Mfr_Name: STMicroelectronics; RefDes: RefDes; Type: Type
U3 = CMP-04916-000061-1: 650-NA QUIESCENT CURRENT, 12-PPM, 3V out
Y1 = CMP-2000-05730-2: Crystal 8MHz ±10ppm 10pF SMD-4 5mm x 3.2mm; Series Resistance: 200R; Load Capacitance: 10pF; Max Operating Temperature: 60°C; Frequency: 8MHz; Height - Seated (Max): 0.043inch; Frequency Tolerance: 10ppm; Packaging: Tape and Reel; Lead Free: Lead Free; Case/Package: SMD/SMT; Series: ABM3B; Min Operating Temperature: -10°C; REACH SVHC: No SVHC; Length: 0.197inch; RoHS Compliant: Yes; Depth: 3.2mm; Height: 0.043inch; Number of Pins: 4; Mount: Surface Mount; Frequency Stability: 10ppm; Width: 0.126inch; ESR (Equivalent Series Resistance): 200R